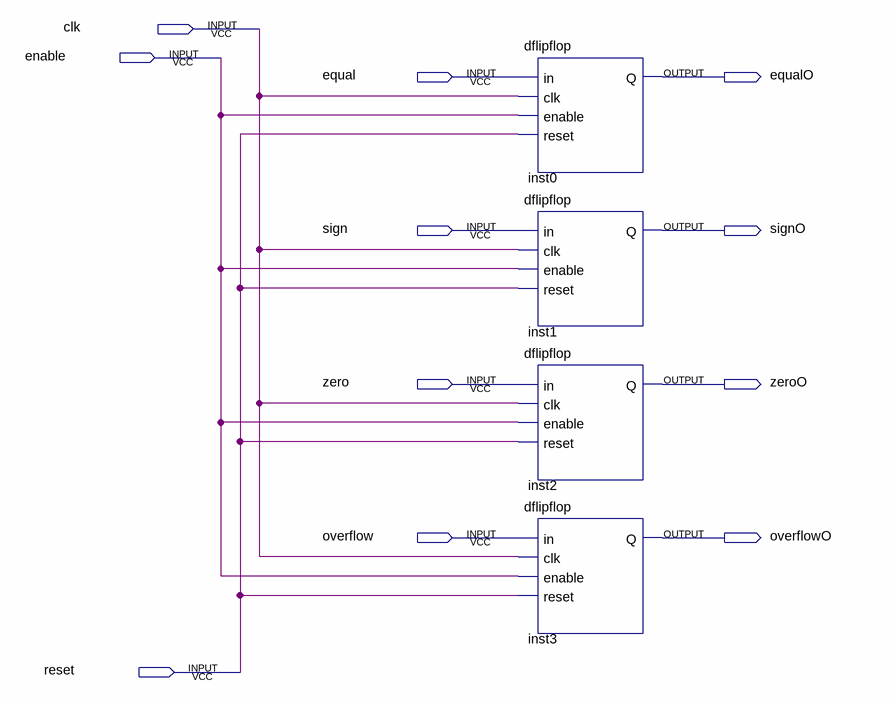
[diagram p0: schematic sheet]
// Quartus schematic controlsigs.bdf as structural Verilog: 4 symbols, 11 pins
module controlsigs (
  input  clk,
  input  enable,
  input  equal,
  input  sign,
  input  zero,
  input  overflow,
  input  reset,
  output equalO,
  output signO,
  output zeroO,
  output overflowO
);

  dflipflop inst0 (.in(equal), .clk(clk), .enable(enable), .reset(reset), .Q(equalO));
  dflipflop inst1 (.in(sign), .clk(clk), .enable(enable), .reset(reset), .Q(signO));
  dflipflop inst2 (.in(zero), .clk(clk), .enable(enable), .reset(reset), .Q(zeroO));
  dflipflop inst3 (.in(overflow), .clk(clk), .enable(enable), .reset(reset), .Q(overflowO));
endmodule
